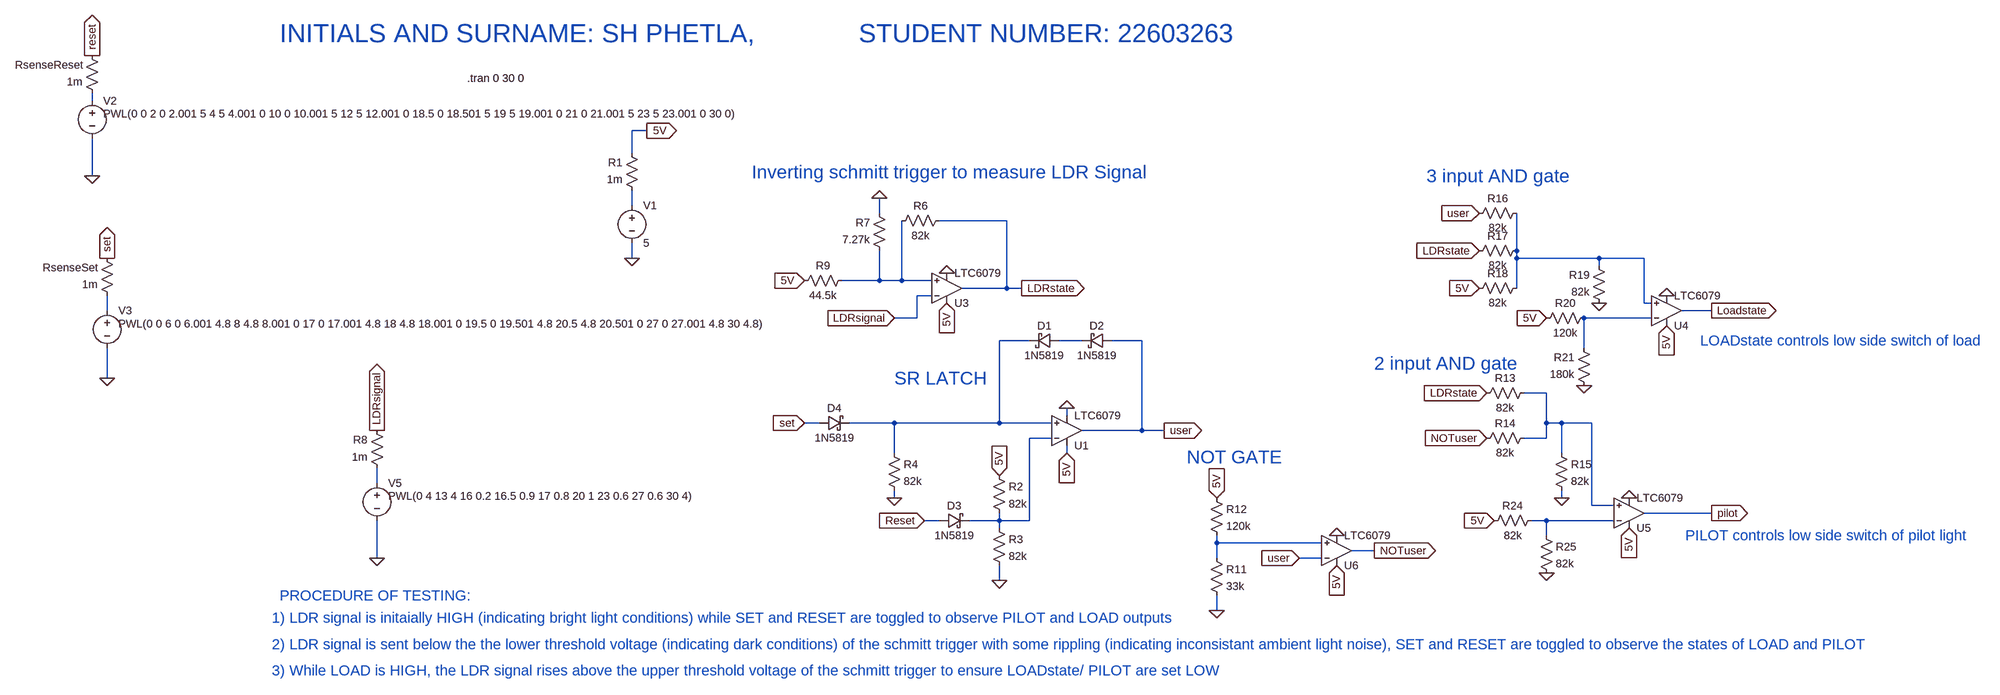
[diagram p0: schematic E344_22603263_A7.asc]
E344_22603263_A7.asc, the LTspice schematic file:
Version 4
SHEET 1 1232 1288
WIRE -3104 -304 -3104 -320
WIRE -1920 -240 -1952 -240
WIRE -1952 -192 -1952 -240
WIRE -3104 -144 -3104 -224
WIRE -1952 -80 -1952 -112
WIRE -1424 -64 -1424 -96
WIRE -1152 -48 -1296 -48
WIRE -64 16 -64 -64
WIRE -1952 32 -1952 0
WIRE -64 32 -64 16
WIRE 112 32 -64 32
WIRE 208 32 112 32
WIRE 112 48 112 32
WIRE -1424 80 -1424 16
WIRE -1424 80 -1504 80
WIRE -1376 80 -1376 -48
WIRE -1376 80 -1424 80
WIRE -1312 80 -1376 80
WIRE -1152 96 -1152 -48
WIRE -1152 96 -1248 96
WIRE -1120 96 -1152 96
WIRE -64 96 -64 32
WIRE -1312 112 -1344 112
WIRE 208 128 208 32
WIRE 224 128 208 128
WIRE -3072 144 -3072 112
WIRE 352 144 288 144
WIRE -1344 160 -1344 112
WIRE -1344 160 -1392 160
WIRE 224 160 80 160
WIRE -1104 208 -1168 208
WIRE -992 208 -1040 208
WIRE -864 208 -928 208
WIRE 80 224 80 160
WIRE -3072 288 -3072 224
WIRE 0 320 -48 320
WIRE -1024 368 -1024 352
WIRE -1552 384 -1584 384
WIRE -1392 384 -1488 384
WIRE -1168 384 -1168 208
WIRE -1168 384 -1392 384
WIRE -1056 384 -1168 384
WIRE 0 384 0 320
WIRE 32 384 0 384
WIRE 96 384 32 384
WIRE -864 400 -864 208
WIRE -864 400 -992 400
WIRE -816 400 -864 400
WIRE -1056 416 -1104 416
WIRE 0 416 0 384
WIRE 0 416 -48 416
WIRE -1392 448 -1392 384
WIRE -1024 448 -1024 432
WIRE 32 448 32 384
WIRE -2496 512 -2496 480
WIRE -1392 544 -1392 528
WIRE 32 544 32 528
WIRE 96 560 96 384
WIRE 144 560 96 560
WIRE 352 576 208 576
WIRE -1296 592 -1328 592
WIRE -1168 592 -1168 576
WIRE -1168 592 -1232 592
WIRE -1104 592 -1104 416
WIRE -1104 592 -1168 592
WIRE 0 592 -32 592
WIRE 144 592 0 592
WIRE -1168 608 -1168 592
WIRE 0 624 0 592
WIRE -704 640 -704 624
WIRE -480 640 -704 640
WIRE -368 656 -416 656
WIRE -2496 672 -2496 592
WIRE -704 672 -704 640
WIRE -480 672 -528 672
WIRE -1168 720 -1168 688
WIRE -704 784 -704 752
FLAG -1920 -240 5V
IOPIN -1920 -240 Out
FLAG -1952 32 0
FLAG -1024 448 5V
IOPIN -1024 448 In
FLAG -816 400 user
IOPIN -816 400 Out
FLAG -1024 352 0
FLAG -1168 496 5V
IOPIN -1168 496 In
FLAG -1168 720 0
FLAG -1392 544 0
FLAG -1584 384 set
IOPIN -1584 384 In
FLAG -1328 592 Reset
IOPIN -1328 592 In
FLAG -3072 288 0
FLAG -3104 -144 0
FLAG -3072 32 set
IOPIN -3072 32 Out
FLAG -3104 -400 reset
IOPIN -3104 -400 Out
FLAG 256 176 5V
IOPIN 256 176 In
FLAG -112 592 5V
IOPIN -112 592 In
FLAG 176 608 5V
IOPIN 176 608 In
FLAG -1280 128 5V
IOPIN -1280 128 In
FLAG -1584 80 5V
IOPIN -1584 80 In
FLAG -2496 672 0
FLAG -2496 400 LDRsignal
IOPIN -2496 400 Out
FLAG -1424 -96 0
FLAG -1392 160 LDRsignal
IOPIN -1392 160 In
FLAG -1120 96 LDRstate
IOPIN -1120 96 Out
FLAG -1280 64 0
FLAG -448 688 5V
IOPIN -448 688 In
FLAG -704 784 0
FLAG -528 672 user
IOPIN -528 672 In
FLAG -368 656 NOTuser
IOPIN -368 656 Out
FLAG -448 624 0
FLAG -704 544 5V
IOPIN -704 544 In
FLAG -128 416 NOTuser
IOPIN -128 416 In
FLAG -128 320 LDRstate
IOPIN -128 320 In
FLAG 32 544 0
FLAG 176 544 0
FLAG 0 704 0
FLAG 352 576 pilot
IOPIN 352 576 Out
FLAG 0 160 5V
IOPIN 0 160 In
FLAG 256 112 0
FLAG 80 304 0
FLAG 112 128 0
FLAG -144 96 5V
IOPIN -144 96 In
FLAG -144 16 LDRstate
IOPIN -144 16 In
FLAG -144 -64 user
IOPIN -144 -64 In
FLAG 352 144 Loadstate
IOPIN 352 144 Out
SYMBOL schottky -1040 192 R90
WINDOW 0 0 32 VBottom 2
WINDOW 3 32 32 VTop 2
SYMATTR InstName D1
SYMATTR Value 1N5819
SYMATTR Description Diode
SYMATTR Type diode
SYMBOL schottky -928 192 R90
WINDOW 0 0 32 VBottom 2
WINDOW 3 32 32 VTop 2
SYMATTR InstName D2
SYMATTR Value 1N5819
SYMATTR Description Diode
SYMATTR Type diode
SYMBOL schottky -1552 400 R270
WINDOW 0 32 32 VTop 2
WINDOW 3 0 32 VBottom 2
SYMATTR InstName D4
SYMATTR Value 1N5819
SYMATTR Description Diode
SYMATTR Type diode
SYMBOL schottky -1296 608 R270
WINDOW 0 32 32 VTop 2
WINDOW 3 0 32 VBottom 2
SYMATTR InstName D3
SYMATTR Value 1N5819
SYMATTR Description Diode
SYMATTR Type diode
SYMBOL Opamps\\LTC6079 -1024 400 M180
SYMATTR InstName U1
SYMBOL voltage -1952 -96 R0
WINDOW 123 0 0 Left 0
WINDOW 39 0 0 Left 0
SYMATTR InstName V1
SYMATTR Value 5
SYMBOL res -1936 -96 R180
WINDOW 0 36 76 Left 2
WINDOW 3 36 40 Left 2
SYMATTR InstName R1
SYMATTR Value 1m
SYMBOL res -1184 480 R0
SYMATTR InstName R2
SYMATTR Value 82k
SYMBOL res -1184 592 R0
SYMATTR InstName R3
SYMATTR Value 82k
SYMBOL res -1408 432 R0
SYMATTR InstName R4
SYMATTR Value 82k
SYMBOL voltage -3104 -320 R0
WINDOW 123 0 0 Left 0
WINDOW 39 0 0 Left 0
WINDOW 3 24 44 Left 2
SYMATTR InstName V2
SYMATTR Value PWL(0 0 2 0 2.001 5 4 5 4.001 0 10 0 10.001 5 12 5 12.001 0 18.5 0 18.501 5 19 5 19.001 0 21 0 21.001 5 23 5 23.001 0 30 0)
SYMBOL voltage -3072 128 R0
WINDOW 123 0 0 Left 0
WINDOW 39 0 0 Left 0
WINDOW 3 24 44 Left 2
SYMATTR InstName V3
SYMATTR Value PWL(0 0 6 0 6.001 4.8 8 4.8 8.001 0 17 0 17.001 4.8 18 4.8 18.001 0 19.5 0 19.501 4.8 20.5 4.8 20.501 0 27 0 27.001 4.8 30 4.8)
SYMBOL res -3056 128 R180
WINDOW 0 36 76 Left 2
WINDOW 3 36 40 Left 2
SYMATTR InstName RsenseSet
SYMATTR Value 1m
SYMBOL res -3088 -304 R180
WINDOW 0 36 76 Left 2
WINDOW 3 36 40 Left 2
SYMATTR InstName RsenseReset
SYMATTR Value 1m
SYMBOL voltage -2496 496 R0
WINDOW 123 0 0 Left 0
WINDOW 39 0 0 Left 0
WINDOW 3 24 44 Left 2
SYMATTR InstName V5
SYMATTR Value PWL(0 4 13 4 16 0.2 16.5 0.9 17 0.8 20 1 23 0.6 27 0.6 30 4)
SYMBOL res -2480 496 R180
WINDOW 0 36 76 Left 2
WINDOW 3 36 40 Left 2
SYMATTR InstName R8
SYMATTR Value 1m
SYMBOL Opamps\\LTC6079 -1280 96 M180
SYMATTR InstName U3
SYMBOL Opamps\\LTC6079 256 144 M180
SYMATTR InstName U4
SYMBOL Opamps\\LTC6079 176 576 M180
SYMATTR InstName U5
SYMBOL Opamps\\LTC6079 -448 656 M180
SYMATTR InstName U6
SYMBOL res -720 656 R0
SYMATTR InstName R11
SYMATTR Value 33k
SYMBOL res -720 528 R0
SYMATTR InstName R12
SYMATTR Value 120k
SYMBOL res -32 304 R90
WINDOW 0 0 56 VBottom 2
WINDOW 3 32 56 VTop 2
SYMATTR InstName R13
SYMATTR Value 82k
SYMBOL res -32 400 R90
WINDOW 0 0 56 VBottom 2
WINDOW 3 32 56 VTop 2
SYMATTR InstName R14
SYMATTR Value 82k
SYMBOL res 16 432 R0
SYMATTR InstName R15
SYMATTR Value 82k
SYMBOL res -48 -80 R90
WINDOW 0 0 56 VBottom 2
WINDOW 3 32 56 VTop 2
SYMATTR InstName R16
SYMATTR Value 82k
SYMBOL res -48 0 R90
WINDOW 0 0 56 VBottom 2
WINDOW 3 32 56 VTop 2
SYMATTR InstName R17
SYMATTR Value 82k
SYMBOL res -48 80 R90
WINDOW 0 0 56 VBottom 2
WINDOW 3 32 56 VTop 2
SYMATTR InstName R18
SYMATTR Value 82k
SYMBOL res 128 144 R180
WINDOW 0 36 76 Left 2
WINDOW 3 36 40 Left 2
SYMATTR InstName R19
SYMATTR Value 82k
SYMBOL res -16 176 R270
WINDOW 0 32 56 VTop 2
WINDOW 3 0 56 VBottom 2
SYMATTR InstName R20
SYMATTR Value 120k
SYMBOL res 96 320 R180
WINDOW 0 36 76 Left 2
WINDOW 3 36 40 Left 2
SYMATTR InstName R21
SYMATTR Value 180k
SYMBOL res -16 576 R90
WINDOW 0 0 56 VBottom 2
WINDOW 3 32 56 VTop 2
SYMATTR InstName R24
SYMATTR Value 82k
SYMBOL res -16 608 R0
SYMATTR InstName R25
SYMATTR Value 82k
SYMBOL res -1280 -64 R90
WINDOW 0 0 56 VBottom 2
WINDOW 3 32 56 VTop 2
SYMATTR InstName R6
SYMATTR Value 82k
SYMBOL res -1408 32 R180
WINDOW 0 36 76 Left 2
WINDOW 3 36 40 Left 2
SYMATTR InstName R7
SYMATTR Value 7.27k
SYMBOL res -1600 96 R270
WINDOW 0 32 56 VTop 2
WINDOW 3 0 56 VBottom 2
SYMATTR InstName R9
SYMATTR Value 44.5k
TEXT -2304 -352 Left 2 !.tran 0 30 0
TEXT -2704 -448 Left 5 ;INITIALS AND SURNAME: SH PHETLA,              STUDENT NUMBER: 22603263
TEXT -1696 -152 Left 4 ;Inverting schmitt trigger to measure LDR Signal
TEXT -768 456 Left 4 ;NOT GATE
TEXT -1392 288 Left 4 ;SR LATCH
TEXT -256 -144 Left 4 ;3 input AND gate
TEXT -368 256 Left 4 ;2 input AND gate
TEXT -2704 752 Left 3 ;PROCEDURE OF TESTING:
TEXT -2720 800 Left 3 ;1) LDR signal is initaially HIGH (indicating bright light conditions) while SET and RESET are toggled to observe PILOT and LOAD outputs
TEXT -2720 856 Left 3 ;2) LDR signal is sent below the the lower threshold voltage (indicating dark conditions) of the schmitt trigger with some rippling (indicating inconsistant ambient light noise), SET and RESET are toggled to observe the states of LOAD and PILOT
TEXT -2720 912 Left 3 ;3) While LOAD is HIGH, the LDR signal rises above the upper threshold voltage of the schmitt trigger to ensure LOADstate/ PILOT are set LOW
TEXT 328 208 Left 3 ;LOADstate controls low side switch of load
TEXT 296 624 Left 3 ;PILOT controls low side switch of pilot light

The netlist it stands for:
* E344_22603263_A7.asc
D1 N008 N007 1N5819
D2 user N008 1N5819
D4 set N007 1N5819
D3 Reset N010 1N5819
XU1 N007 N010 5V 0 user LTC6078  ; LTC6079, pins In+ In- V+ V- OUT
V1 N002 0 5
R1 N002 5V 1m
R2 5V N010 82k
R3 N010 0 82k
R4 N007 0 82k
V2 N001 0 PWL(0 0 2 0 2.001 5 4 5 4.001 0 10 0 10.001 5 12 5 12.001 0 18.5 0 18.501 5 19 5 19.001 0 21 0 21.001 5 23 5 23.001 0 30 0)
V3 N005 0 PWL(0 0 6 0 6.001 4.8 8 4.8 8.001 0 17 0 17.001 4.8 18 4.8 18.001 0 19.5 0 19.501 4.8 20.5 4.8 20.501 0 27 0 27.001 4.8 30 4.8)
RsenseSet N005 set 1m
RsenseReset N001 Reset 1m
V5 N011 0 PWL(0 4 13 4 16 0.2 16.5 0.9 17 0.8 20 1 23 0.6 27 0.6 30 4)
R8 N011 LDRsignal 1m
XU3 N004 LDRsignal 5V 0 LDRstate LTC6078  ; LTC6079, pins In+ In- V+ V- OUT
XU4 N003 N006 5V 0 Loadstate LTC6078  ; LTC6079, pins In+ In- V+ V- OUT
XU5 N009 N012 5V 0 pilot LTC6078  ; LTC6079, pins In+ In- V+ V- OUT
XU6 N013 user 5V 0 NOTuser LTC6078  ; LTC6079, pins In+ In- V+ V- OUT
R11 N013 0 33k
R12 5V N013 120k
R13 N009 LDRstate 82k
R14 N009 NOTuser 82k
R15 N009 0 82k
R16 N003 user 82k
R17 N003 LDRstate 82k
R18 N003 5V 82k
R19 0 N003 82k
R20 5V N006 120k
R21 0 N006 180k
R24 N012 5V 82k
R25 N012 0 82k
R6 LDRstate N004 82k
R7 N004 0 7.27k
R9 5V N004 44.5k
.model D D
.lib standard.dio
.tran 0 30 0
* INITIALS AND SURNAME: SH PHETLA,              STUDENT NUMBER: 22603263
* Inverting schmitt trigger to measure LDR Signal
* NOT GATE
* SR LATCH
* 3 input AND gate
* 2 input AND gate
* PROCEDURE OF TESTING:
* 1) LDR signal is initaially HIGH (indicating bright light conditions) while SET and RESET are toggled to observe PILOT and LOAD outputs
* 2) LDR signal is sent below the the lower threshold voltage (indicating dark conditions) of the schmitt trigger with some rippling (indicating inconsistant ambient light noise), SET and RESET are toggled to observe the states of LOAD and PILOT
* 3) While LOAD is HIGH, the LDR signal rises above the upper threshold voltage of the schmitt trigger to ensure LOADstate/ PILOT are set LOW
* LOADstate controls low side switch of load
* PILOT controls low side switch of pilot light
.lib LTC5.lib
.backanno
.end